# Altium schematic sheet E-28 Voltmeter.SchDoc: E-28 Voltmeter
size B; DrawnBy: Jeremie Boulianne; Organization: Synthiam Inc.; Address1: Unit 10, 6120 - 11 St. SE; Address2: Calgary, AB; Address3: T2H 2L7; Address4: Canada; Revision: 1
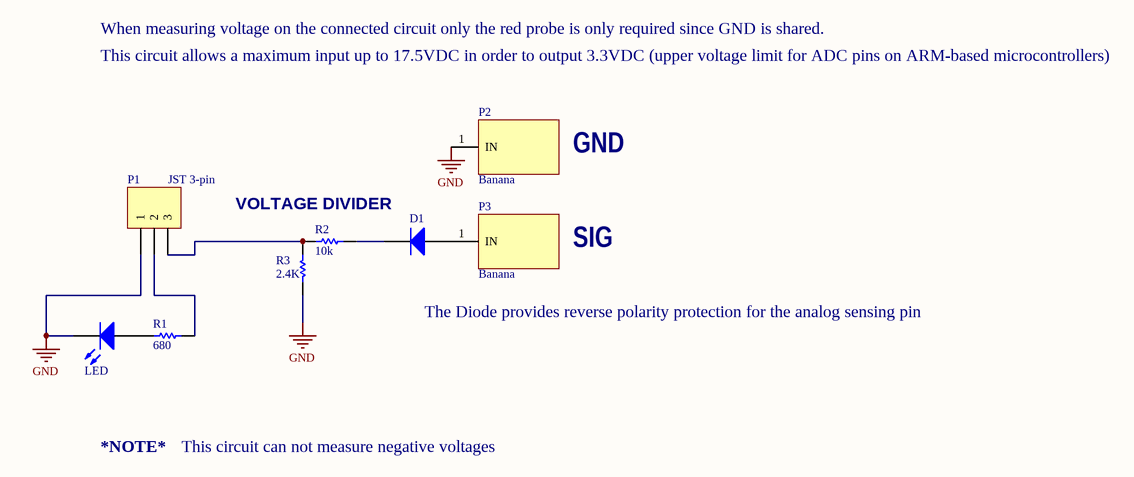
[diagram p0: E-28 Voltmeter.SchDoc]

## Parts
D1  20V 1A  [DIODE SOD-123]  (value not drawn)
LED  LED2  [0805 LED - TIGHT]  (value not drawn)
P1  JST 3-pin  [JST-PH 3-pin SMD]
P2  Banana  [Banana Jack RA]
P3  Banana  [Banana Jack RA]
R1  value 680  [0603 tight]  (hidden comment: Res1)
R2  value 10k  [0603 tight]  (hidden comment: Res1)
R3  value 2.4K  [0603 Tight]  (hidden comment: Res1)

## Nets
GND: LED.2(K) P1.1 P2.1(IN) R3.2
NetD1_1: D1.1(A) P3.1(IN)
NetD1_2: D1.2(K) R2.2
NetLED_1: LED.1(A) R1.1
NetP1_2: P1.2 R1.2
NetP1_3: P1.3 R2.1 R3.1

## Notes on the sheet
- This circuit allows a maximum input up to 17.5VDC in order to output 3.3VDC (upper voltage limit for ADC pins on ARM-based microcontrollers)
- When measuring voltage on the connected circuit only the red probe is only required since GND is shared.
- VOLTAGE DIVIDER
- GND
- SIG
- The Diode provides reverse polarity protection for the analog sensing pin
- *NOTE*
- This circuit can not measure negative voltages
- Property of:
- Size:
- Date:
- B
- Drawn By:
- Time:
- Revision:
- Copyright © 2019 Synthiam Inc. All rights reserved.

## Library data of the parts
D1 = Diode 1N4148: High Conductance Fast Diode; Published: 8-Jun-2000; LatestRevisionDate: 17-Jul-2002; LatestRevisionNote: Re-released for DXP Platform.; DatasheetVersion: 1997; PackageReference: DO-35; Publisher: Altium Limited; Code_JEDEC: DO-204-AH; ComponentLink1Description: Manufacturer Link; ComponentLink1URL: http://www.fairchildsemi.com/; ComponentLink2Description: Datasheet; ComponentLink2URL: http://www.fairchildsemi.com/ds/1N%2F1N4148.pdf
LED = LED1: Typical RED GaAs LED; Published: 8-Jun-2000; LatestRevisionDate: 08-Jul-2005; LatestRevisionNote: Mech Layer 1 removed.; PackageReference: LED-1; Publisher: Altium Limited
P1 = Header 3: Header, 3-Pin; LatestRevisionDate: 17-Jul-2002; LatestRevisionNote: Re-released for DXP Platform.; Publisher: Altium Limited
P2 P3 = Banana Jack RA
R1-R3 = Res1: Resistor; Published: 8-Jun-2000; LatestRevisionDate: 17-Jul-2002; LatestRevisionNote: Re-released for DXP Platform.; PackageReference: AXIAL-0.3; Publisher: Altium Limited